# Altium schematic sheet 接线图.SchDoc
size A3
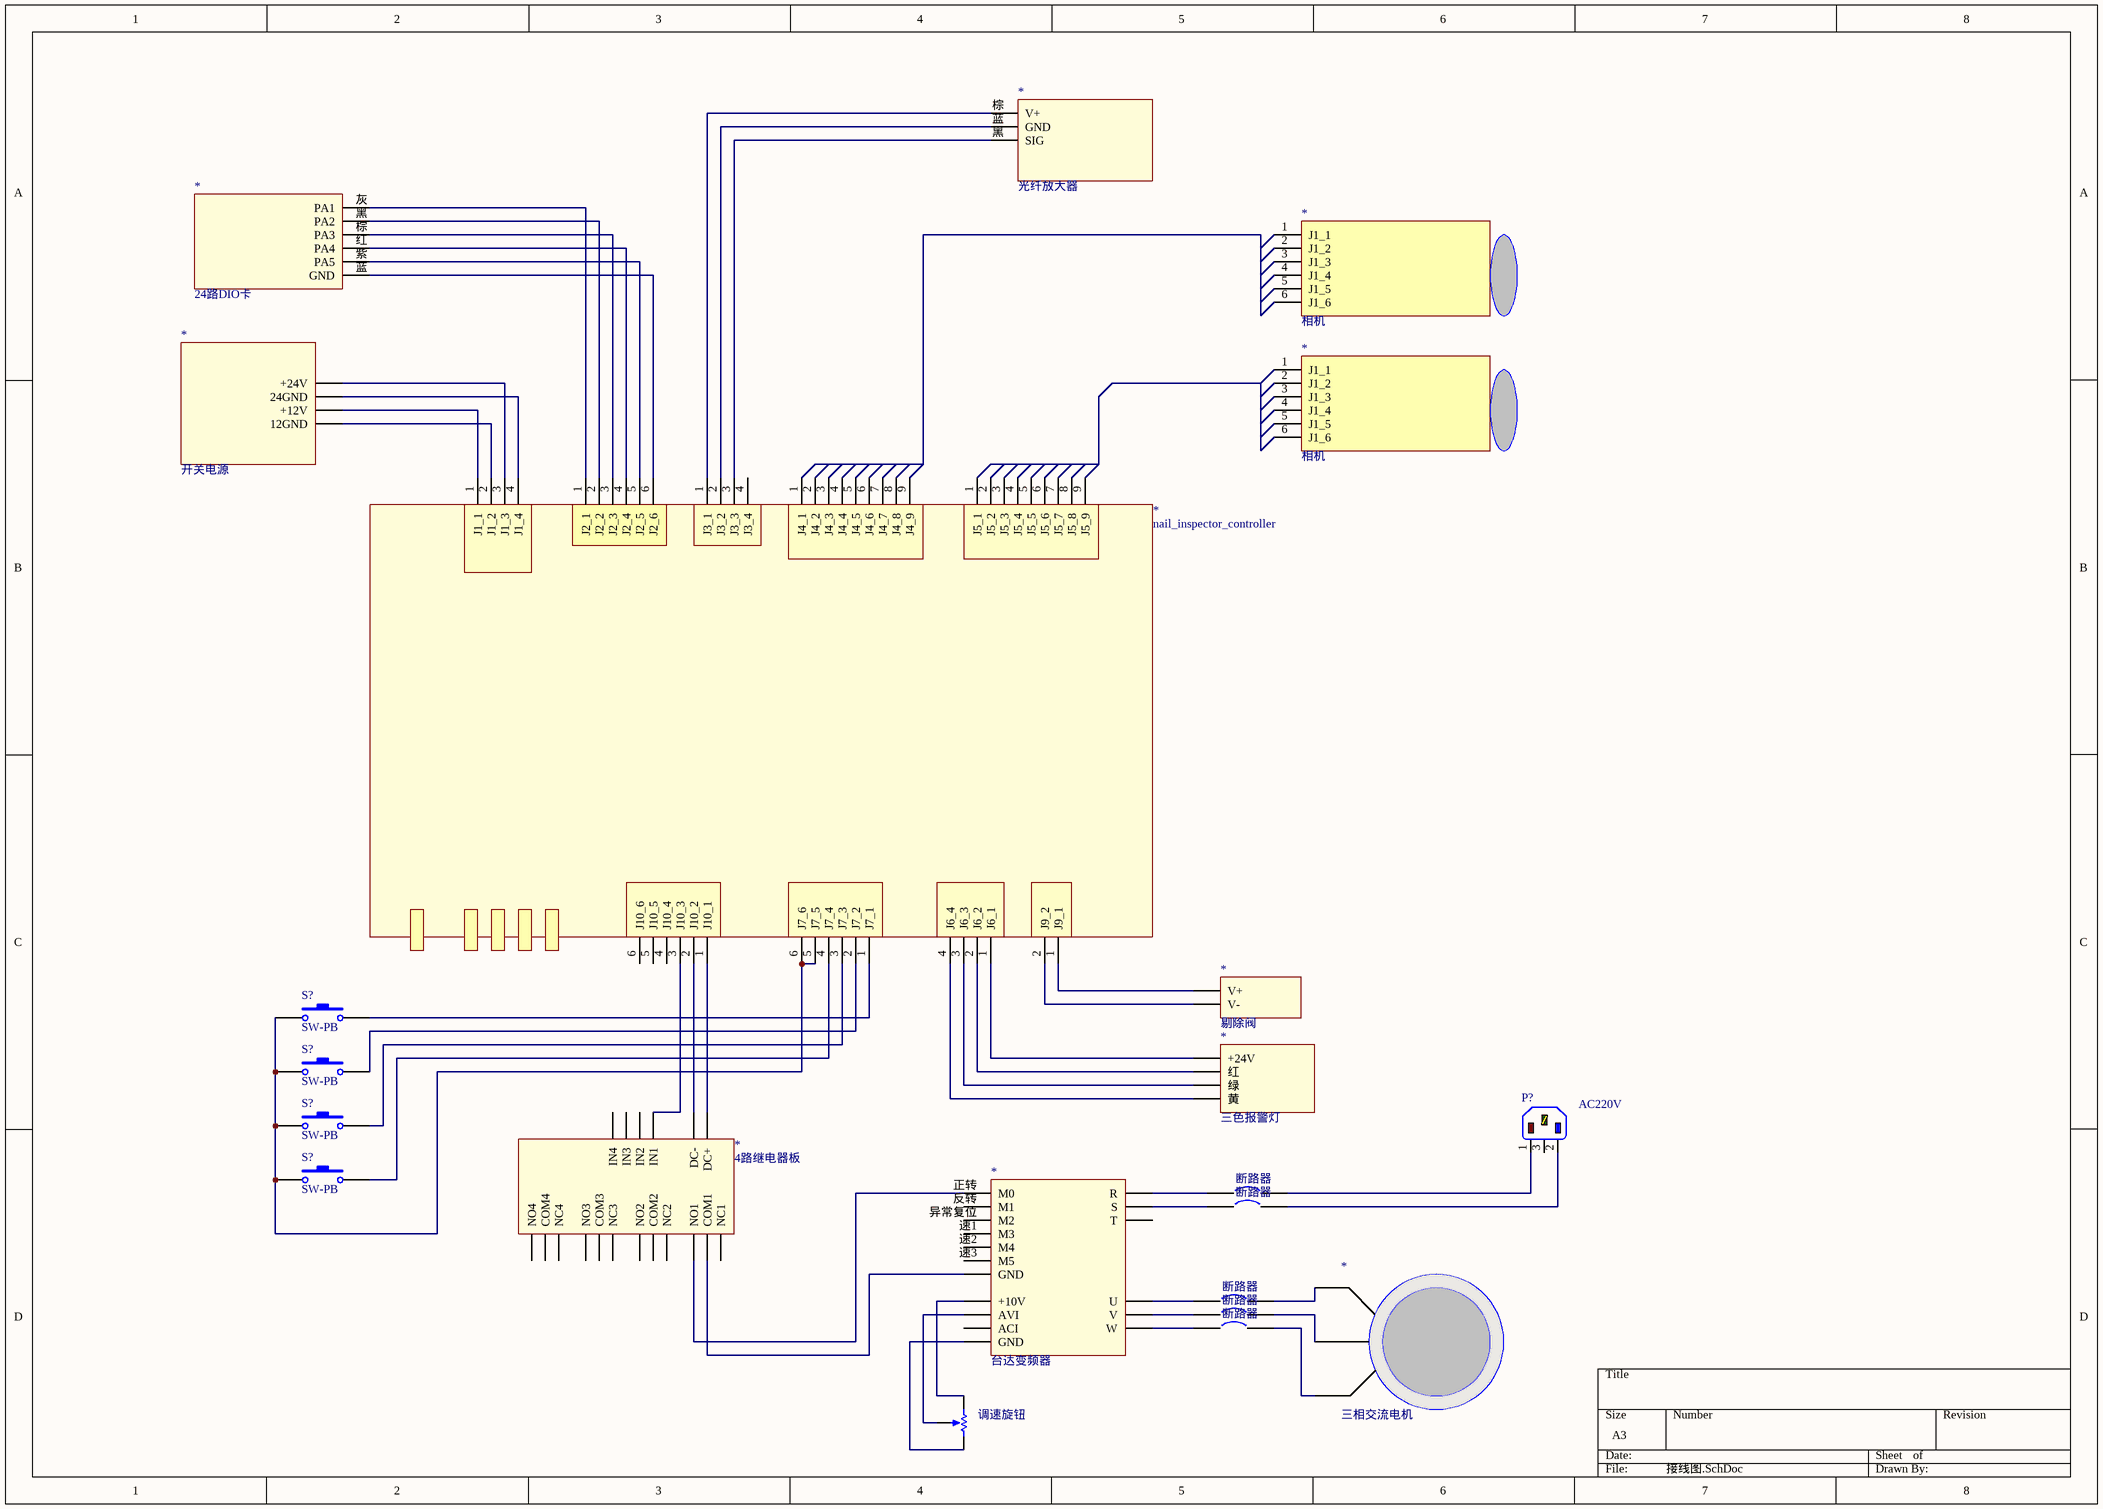
[diagram p0: 接线图.SchDoc]

## Parts
(Parts that share a designator on the sheet are numbered #1, #2 ... from top to bottom, then left to right.)
*#1  光纤放大器
*#2  24路DIO卡
*#3  相机
*#4  相机
*#5  开关电源
*#6  nail_inspector_controller
*#7  剔除阀
*#8  三色报警灯
*#9  4路继电器板
*#10  台达变频器
*#11  三相交流电机
P?  AC220V  [IEC9.14-2H3]
S?#1  SW-PB  [SPST-2]
S?#2  SW-PB  [SPST-2]
S?#3  SW-PB  [SPST-2]
S?#4  SW-PB  [SPST-2]
断路器#1  Circuit Breaker  [SPST-2]  (value not drawn)
断路器#2  Circuit Breaker  [SPST-2]  (value not drawn)
断路器#3  Circuit Breaker  [SPST-2]  (value not drawn)
断路器#4  Circuit Breaker  [SPST-2]  (value not drawn)
断路器#5  Circuit Breaker  [SPST-2]  (value not drawn)
调速旋钮  RPot  [VR5]  (value not drawn)

## Nets
Net*#1_棕: *#1.棕(V+) *#6.1(J3_1)
Net*#1_蓝: *#1.蓝(GND) *#6.2(J3_2)
Net*#1_黑: *#1.黑(SIG) *#6.3(J3_3)
Net*#2_棕: *#2.棕(PA3) *#6.3(J2_3)
Net*#2_灰: *#2.灰(PA1) *#6.1(J2_1)
Net*#2_紫: *#2.紫(PA5) *#6.5(J2_5)
Net*#2_红: *#2.红(PA4) *#6.4(J2_4)
Net*#2_蓝: *#2.蓝(GND) *#6.6(J2_6)
Net*#2_黑: *#2.黑(PA2) *#6.2(J2_2)
Net*#5_?1: *#5.?1(+24V) *#6.3(J1_3)
Net*#5_?2: *#5.?2(24GND) *#6.4(J1_4)
Net*#5_?3: *#5.?3(+12V) *#6.1(J1_1)
Net*#5_?4: *#5.?4(12GND) *#6.2(J1_2)
Net*#6_1: *#6.1(J6_1) *#8.?4(+24V)
Net*#6_1: *#6.1(J7_1) S?#1.2  [a separate net that carries the same name]
Net*#6_1: *#6.1(J9_1) *#7.?1(V+)  [a separate net that carries the same name]
Net*#6_1: *#6.1(J10_1) *#9.?1(DC+)  [a separate net that carries the same name]
Net*#6_2: *#6.2(J6_2) *#8.?1(红)
Net*#6_2: *#6.2(J7_2) S?#2.2  [a separate net that carries the same name]
Net*#6_2: *#6.2(J9_2) *#7.?2(V-)  [a separate net that carries the same name]
Net*#6_2: *#6.2(J10_2) *#9.?2(DC-)  [a separate net that carries the same name]
Net*#6_3: *#6.3(J6_3) *#8.?2(绿)
Net*#6_3: *#6.3(J7_3) S?#3.2  [a separate net that carries the same name]
Net*#6_3: *#6.3(J10_3) *#9.?3(IN1)  [a separate net that carries the same name]
Net*#6_4: *#6.4(J6_4) *#8.?3(黄)
Net*#6_4: *#6.4(J7_4) S?#4.2  [a separate net that carries the same name]
Net*#6_5: *#6.5(J7_5) *#6.6(J7_6) S?#1.1 S?#2.1 S?#3.1 S?#4.1
Net*#9_?11: *#9.?11(COM1) *#10.?1(GND)
Net*#9_?15: *#9.?15(NO1) *#10.正转(M0)
Net*#10_?2: *#10.?2(+10V) 调速旋钮.1(TOP)
Net*#10_?3: *#10.?3(AVI) 调速旋钮.3(TAP)
Net*#10_?5: *#10.?5(GND) 调速旋钮.2(BOT)
Net*#10_?6: *#10.?6(U) 断路器#3.1
Net*#10_?7: *#10.?7(V) 断路器#4.1
Net*#10_?8: *#10.?8(W) 断路器#5.1
Net*#10_?9: *#10.?9(R) 断路器#1.1
Net*#10_?10: *#10.?10(S) 断路器#2.1
Net*#11_?3: *#11.?3 断路器#5.2
NetP?_1: P?.1(L) 断路器#1.2
NetP?_2: P?.2(N) 断路器#2.2

Not connected (* = marked no-connect by the designer): *#3 1(J1_1) 2(J1_2) 3(J1_3) 4(J1_4) 5(J1_5) 6(J1_6); *#4 1(J1_1) 2(J1_2) 3(J1_3) 4(J1_4) 5(J1_5) 6(J1_6); *#6 7(J4_7) 8(J4_8) 9(J4_9); *#9 ?4(IN2) ?5(IN3) ?6(IN4) ?7(NC1) ?8(NC2) ?9(NC3) ?10(NC4) ?12(COM2) ?13(COM3) ?14(COM4) ?16(NO2) ?17(NO3) ?18(NO4); *#10 ?4(ACI) ?11(T) 反转(M1) 异常复位(M2) 速1(M3) 速2(M4) 速3(M5); *#11 ?1(_) ?2(_); P? 3(E); 断路器#3 2; 断路器#4 2

## Library data of the parts
P? = Plug AC Male: IEC Mains Power Inlet, EN60 320-1 C14 Class I Cold Condition, PC Flange Rear Mount, Chassis Plug; PackageDocument: ver.80, 15-Sep-2003; MaximumRating: 10A, 250V a.c. (UL & CSA 15A, 250V a.c.); MountingFixtures: Not drawn on schematic symbol.; PCB_Layout: Complies with manufacturer's recommendation.; DrillSize: Corresponds to nominal value.; Note: IEC Color Scheme employed for L, N and E.; Published: 15-Jul-2004; LatestRevisionDate: 15-Jul-2004; LatestRevisionNote: Component Replaced.; DatasheetDocument: ver.80, 15-Sep-2003; PackageReference: PX0580/PC; Publisher: Altium Limited; Terminations: P.C. Spills; ComponentLink1Description: Manufacturer Link; ComponentLink1URL: http://www.bulgin.co.uk/
S?#1-S?#4 = SW-PB: Switch; Published: 24-Mar-1999; LatestRevisionDate: 17-Jul-2002; LatestRevisionNote: Re-released for DXP Platform.; PackageReference: SPST-2; Publisher: Altium Limited; PackageDescription: Switch; 2 Leads
调速旋钮 = RPot: Potentiometer; Sim Note: Enter the Resistance value and the set point into parameter fields.; Set Position: 0.5; Value: 1K; Published: 8-Jun-2000; LatestRevisionDate: 17-Jul-2002; LatestRevisionNote: Re-released for DXP Platform.; PackageReference: VR5; Publisher: Altium Limited; PackageDescription: Variable Resistor, Thru-Hole; 3 Leads
断路器#1-断路器#5 = Circuit Breaker: Published: 24-Mar-1999; LatestRevisionDate: 17-Jul-2002; LatestRevisionNote: Re-released for DXP Platform.; PackageReference: SPST-2; Publisher: Altium Limited; PackageDescription: Switch; 2 Leads